# Altium schematic sheet GPS总图.SchDoc
size A4; DocumentNumber: 20; SheetNumber: 20; SheetTotal: 34
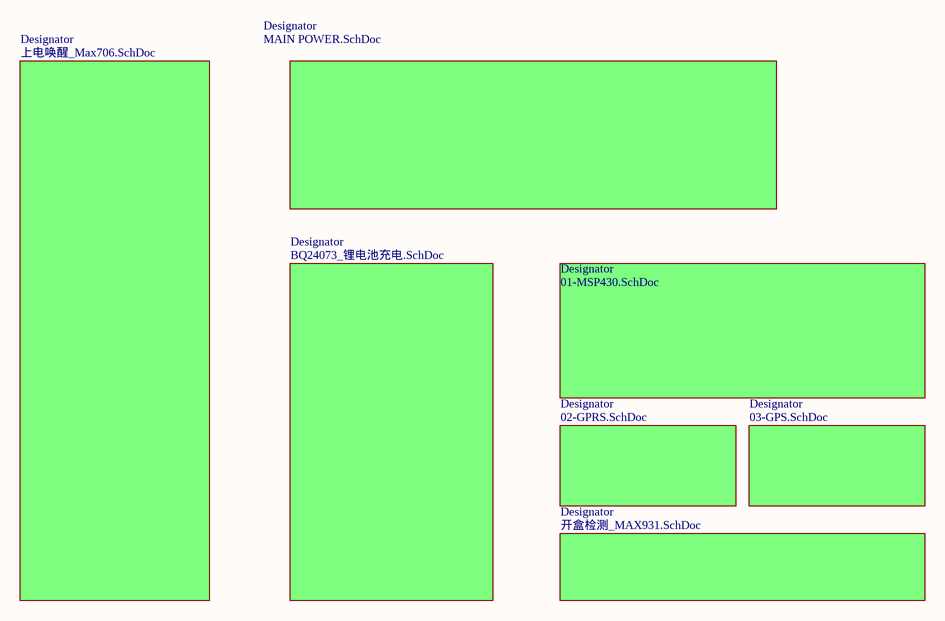
[diagram p0: GPS总图.SchDoc]

## Sub-sheets
Designator = 01-MSP430.SchDoc: no entries
Designator = 02-GPRS.SchDoc: no entries
Designator = 03-GPS.SchDoc: no entries
Designator = BQ24073_锂电池充电.SchDoc: no entries
Designator = 开盒检测_MAX931.SchDoc: no entries
Designator = MAIN POWER.SchDoc: no entries
Designator = 上电唤醒_Max706.SchDoc: no entries